# Altium schematic sheet Top.SchDoc: Top
size A3; Project: STM32L073Z-EVAL; Date: Not used; ApprovedBy: Not used; CheckedBy: Not used; Author: Not used; CompanyName: STMicroelectronics; DrawnBy: Not used; Engineer: Not used; Organization: Not used; Address1: Not used; Address2: Not used; Address3: Not used; Address4: Not used; DocumentNumber: 1; Revision: Not used; SheetNumber: 2; SheetTotal: 13; CurrentTime: Not used; CurrentDate: Not used; Time: Not used; DocumentFullPathAndName: Not used; DocumentName: Not used; ModifiedDate: Not used; ImagePath: Not used; ProjectName: Not used; Application_BuildNumber: Not used
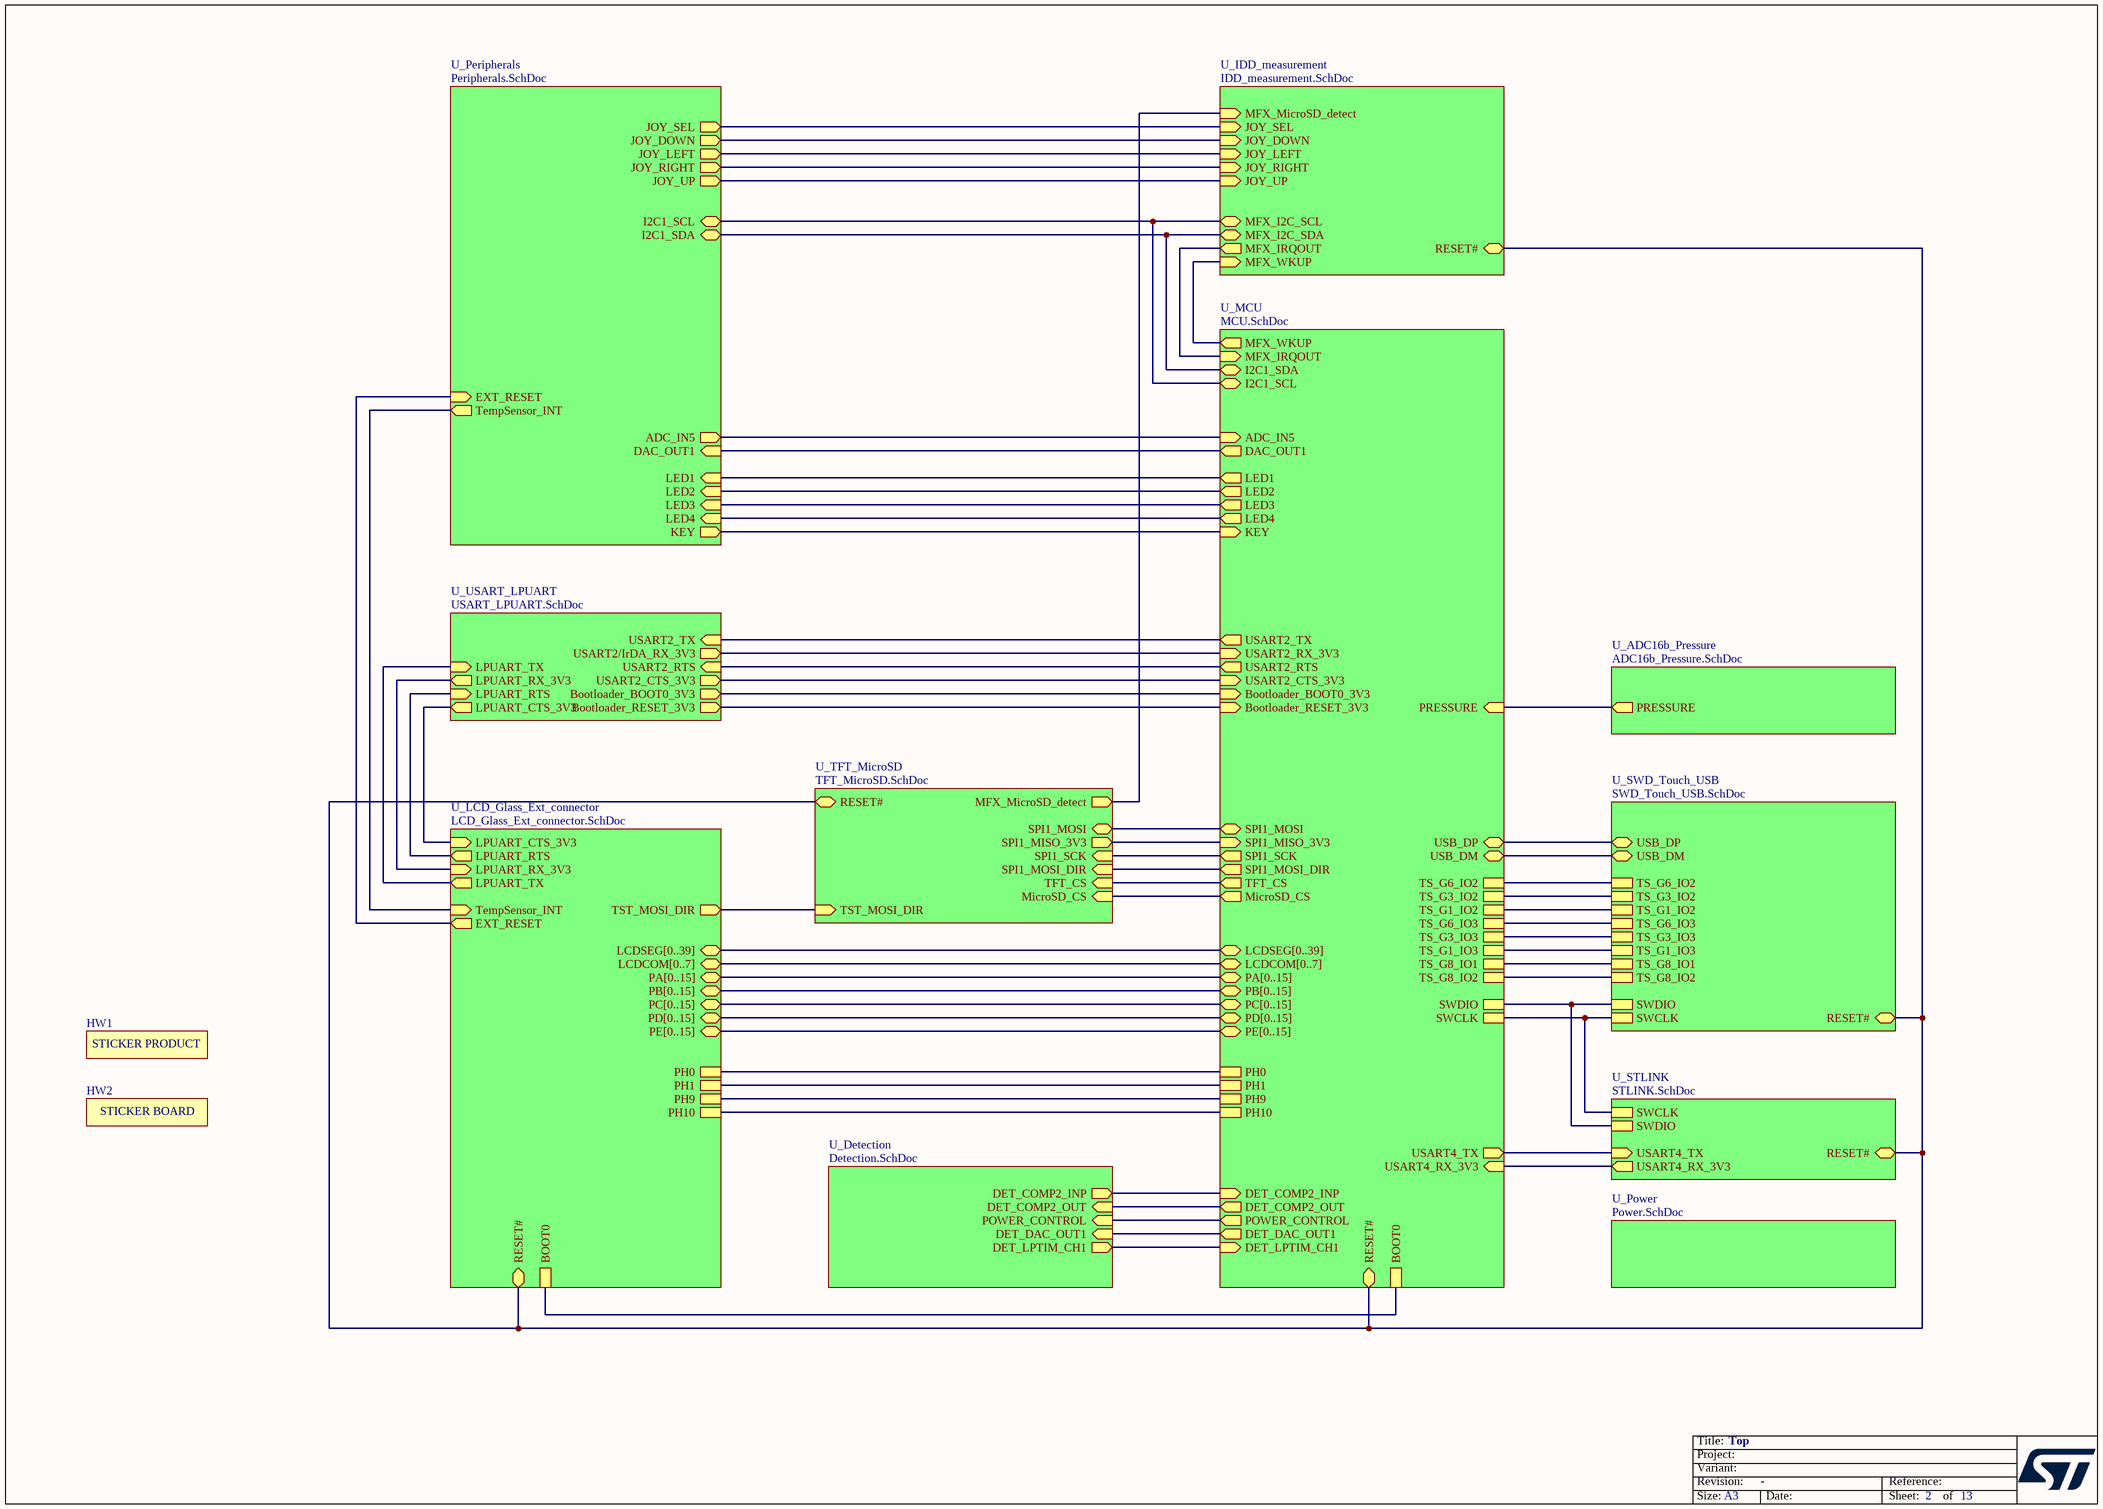
[diagram p0: Top.SchDoc]

## Parts
HW1  STICKER_PRODUCT  (value not drawn)  (no BOM)
HW2  STICKER_BOARD  (value not drawn)  (no BOM)

## Sub-sheets
U_ADC16b_Pressure = ADC16b_Pressure.SchDoc: PRESSURE (out)
U_Detection = Detection.SchDoc: DET_COMP2_INP (out), DET_COMP2_OUT (in), DET_DAC_OUT1 (in), POWER_CONTROL (in), DET_LPTIM_CH1 (out)
U_IDD_measurement = IDD_measurement.SchDoc: MFX_IRQOUT (out), JOY_SEL (in), JOY_DOWN (in), JOY_LEFT (in), JOY_RIGHT (in), JOY_UP (in), MFX_WKUP (in), MFX_MicroSD_detect (in), RESET# (bidir), MFX_I2C_SDA (bidir), MFX_I2C_SCL (bidir)
U_LCD_Glass_Ext_connector = LCD_Glass_Ext_connector.SchDoc: LCDSEG[0..39] (bidir), LCDCOM[0..7] (bidir), LPUART_RX_3V3 (in), LPUART_TX (out), LPUART_CTS_3V3 (in), LPUART_RTS (out), TST_MOSI_DIR (out), TempSensor_INT (in), EXT_RESET (out), PA[0..15] (bidir), PB[0..15] (bidir), PC[0..15] (bidir), PD[0..15] (bidir), PE[0..15] (bidir), RESET# (bidir), PH1, PH0, BOOT0, PH10, PH9
U_MCU = MCU.SchDoc: I2C1_SDA (bidir), I2C1_SCL (bidir), MFX_IRQOUT (in), Bootloader_BOOT0_3V3 (in), Bootloader_RESET_3V3 (in), BOOT0, USART2_RX_3V3 (in), USART2_CTS_3V3 (in), USART2_TX (out), USART2_RTS (out), SPI1_SCK (out), SPI1_MOSI (bidir), MicroSD_CS (out), TFT_CS (out), KEY (in), LED4 (out), LED3 (out), LED1 (out), LED2 (out), USART4_RX_3V3 (in), USART4_TX (out), PRESSURE (in), TS_G1_IO2, TS_G1_IO3, DAC_OUT1 (out), TS_G3_IO2, TS_G3_IO3, TS_G6_IO2, TS_G6_IO3, ADC_IN5 (in), USB_DM (bidir), USB_DP (bidir), SWDIO, SWCLK, SPI1_MISO_3V3 (in), DET_DAC_OUT1 (out), SPI1_MOSI_DIR (out), LCDSEG[0..39] (bidir), LCDCOM[0..7] (bidir), PA[0..15] (bidir), PB[0..15] (bidir), PC[0..15] (bidir), PD[0..15] (bidir), PE[0..15] (bidir), RESET# (bidir), PH1, PH0, PH10, PH9, MFX_WKUP (out), TS_G8_IO1, TS_G8_IO2, DET_COMP2_INP (in), POWER_CONTROL (out), DET_COMP2_OUT (out), DET_LPTIM_CH1 (in)
U_Peripherals = Peripherals.SchDoc: I2C1_SDA (bidir), TempSensor_INT (out), EXT_RESET (in), JOY_SEL (out), JOY_DOWN (out), JOY_LEFT (out), JOY_RIGHT (out), JOY_UP (out), DAC_OUT1 (in), ADC_IN5 (out), KEY (out), LED4 (in), LED3 (in), LED1 (in), LED2 (in), I2C1_SCL (bidir)
U_Power = Power.SchDoc: no entries
U_STLINK = STLINK.SchDoc: USART4_RX_3V3 (out), USART4_TX (in), SWDIO, SWCLK, RESET# (bidir)
U_SWD_Touch_USB = SWD_Touch_USB.SchDoc: RESET# (bidir), SWDIO, SWCLK, USB_DM (bidir), USB_DP (bidir), TS_G1_IO2, TS_G6_IO2, TS_G3_IO2, TS_G6_IO3, TS_G3_IO3, TS_G1_IO3, TS_G8_IO1, TS_G8_IO2
U_TFT_MicroSD = TFT_MicroSD.SchDoc: MFX_MicroSD_detect (out), RESET# (bidir), SPI1_MISO_3V3 (out), SPI1_MOSI (bidir), SPI1_MOSI_DIR (in), SPI1_SCK (in), MicroSD_CS (in), TFT_CS (in), TST_MOSI_DIR (in)
U_USART_LPUART = USART_LPUART.SchDoc: USART2/IrDA_RX_3V3 (out), Bootloader_BOOT0_3V3 (out), Bootloader_RESET_3V3 (out), USART2_CTS_3V3 (out), USART2_TX (in), USART2_RTS (in), LPUART_RX_3V3 (out), LPUART_CTS_3V3 (out), LPUART_TX (in), LPUART_RTS (in)

## Nets
(unnamed): sheet U_MCU/I2C1_SDA, sheet U_IDD_measurement/MFX_I2C_SDA, sheet U_Peripherals/I2C1_SDA
(unnamed): sheet U_MCU/I2C1_SCL, sheet U_IDD_measurement/MFX_I2C_SCL, sheet U_Peripherals/I2C1_SCL
(unnamed): sheet U_MCU/MFX_IRQOUT, sheet U_IDD_measurement/MFX_IRQOUT
(unnamed): sheet U_MCU/Bootloader_BOOT0_3V3, sheet U_USART_LPUART/Bootloader_BOOT0_3V3
(unnamed): sheet U_MCU/Bootloader_RESET_3V3, sheet U_USART_LPUART/Bootloader_RESET_3V3
(unnamed): sheet U_MCU/BOOT0, sheet U_LCD_Glass_Ext_connector/BOOT0
(unnamed): sheet U_MCU/USART2_RX_3V3, sheet U_USART_LPUART/USART2/IrDA_RX_3V3
(unnamed): sheet U_MCU/USART2_CTS_3V3, sheet U_USART_LPUART/USART2_CTS_3V3
(unnamed): sheet U_MCU/USART2_TX, sheet U_USART_LPUART/USART2_TX
(unnamed): sheet U_MCU/USART2_RTS, sheet U_USART_LPUART/USART2_RTS
(unnamed): sheet U_MCU/SPI1_SCK, sheet U_TFT_MicroSD/SPI1_SCK
(unnamed): sheet U_MCU/SPI1_MOSI, sheet U_TFT_MicroSD/SPI1_MOSI
(unnamed): sheet U_MCU/MicroSD_CS, sheet U_TFT_MicroSD/MicroSD_CS
(unnamed): sheet U_MCU/TFT_CS, sheet U_TFT_MicroSD/TFT_CS
(unnamed): sheet U_MCU/KEY, sheet U_Peripherals/KEY
(unnamed): sheet U_MCU/LED4, sheet U_Peripherals/LED4
(unnamed): sheet U_MCU/LED3, sheet U_Peripherals/LED3
(unnamed): sheet U_MCU/LED1, sheet U_Peripherals/LED1
(unnamed): sheet U_MCU/LED2, sheet U_Peripherals/LED2
(unnamed): sheet U_MCU/USART4_RX_3V3, sheet U_STLINK/USART4_RX_3V3
(unnamed): sheet U_MCU/USART4_TX, sheet U_STLINK/USART4_TX
(unnamed): sheet U_MCU/PRESSURE, sheet U_ADC16b_Pressure/PRESSURE
(unnamed): sheet U_MCU/TS_G1_IO2, sheet U_SWD_Touch_USB/TS_G1_IO2
(unnamed): sheet U_MCU/TS_G1_IO3, sheet U_SWD_Touch_USB/TS_G1_IO3
(unnamed): sheet U_MCU/DAC_OUT1, sheet U_Peripherals/DAC_OUT1
(unnamed): sheet U_MCU/TS_G3_IO2, sheet U_SWD_Touch_USB/TS_G3_IO2
(unnamed): sheet U_MCU/TS_G3_IO3, sheet U_SWD_Touch_USB/TS_G3_IO3
(unnamed): sheet U_MCU/TS_G6_IO2, sheet U_SWD_Touch_USB/TS_G6_IO2
(unnamed): sheet U_MCU/TS_G6_IO3, sheet U_SWD_Touch_USB/TS_G6_IO3
(unnamed): sheet U_MCU/ADC_IN5, sheet U_Peripherals/ADC_IN5
(unnamed): sheet U_MCU/USB_DM, sheet U_SWD_Touch_USB/USB_DM
(unnamed): sheet U_MCU/USB_DP, sheet U_SWD_Touch_USB/USB_DP
(unnamed): sheet U_MCU/SWDIO, sheet U_STLINK/SWDIO, sheet U_SWD_Touch_USB/SWDIO
(unnamed): sheet U_MCU/SWCLK, sheet U_STLINK/SWCLK, sheet U_SWD_Touch_USB/SWCLK
(unnamed): sheet U_MCU/SPI1_MISO_3V3, sheet U_TFT_MicroSD/SPI1_MISO_3V3
(unnamed): sheet U_MCU/DET_DAC_OUT1, sheet U_Detection/DET_DAC_OUT1
(unnamed): sheet U_MCU/SPI1_MOSI_DIR, sheet U_TFT_MicroSD/SPI1_MOSI_DIR
(unnamed): sheet U_MCU/RESET#, sheet U_IDD_measurement/RESET#, sheet U_LCD_Glass_Ext_connector/RESET#, sheet U_STLINK/RESET#, sheet U_TFT_MicroSD/RESET#, sheet U_SWD_Touch_USB/RESET#
(unnamed): sheet U_MCU/PH1, sheet U_LCD_Glass_Ext_connector/PH1
(unnamed): sheet U_MCU/PH0, sheet U_LCD_Glass_Ext_connector/PH0
(unnamed): sheet U_MCU/PH10, sheet U_LCD_Glass_Ext_connector/PH10
(unnamed): sheet U_MCU/PH9, sheet U_LCD_Glass_Ext_connector/PH9
(unnamed): sheet U_MCU/MFX_WKUP, sheet U_IDD_measurement/MFX_WKUP
(unnamed): sheet U_MCU/TS_G8_IO1, sheet U_SWD_Touch_USB/TS_G8_IO1
(unnamed): sheet U_MCU/TS_G8_IO2, sheet U_SWD_Touch_USB/TS_G8_IO2
(unnamed): sheet U_MCU/DET_COMP2_INP, sheet U_Detection/DET_COMP2_INP
(unnamed): sheet U_MCU/POWER_CONTROL, sheet U_Detection/POWER_CONTROL
(unnamed): sheet U_MCU/DET_COMP2_OUT, sheet U_Detection/DET_COMP2_OUT
(unnamed): sheet U_MCU/DET_LPTIM_CH1, sheet U_Detection/DET_LPTIM_CH1
(unnamed): sheet U_IDD_measurement/JOY_SEL, sheet U_Peripherals/JOY_SEL
(unnamed): sheet U_IDD_measurement/JOY_DOWN, sheet U_Peripherals/JOY_DOWN
(unnamed): sheet U_IDD_measurement/JOY_LEFT, sheet U_Peripherals/JOY_LEFT
(unnamed): sheet U_IDD_measurement/JOY_RIGHT, sheet U_Peripherals/JOY_RIGHT
(unnamed): sheet U_IDD_measurement/JOY_UP, sheet U_Peripherals/JOY_UP
(unnamed): sheet U_IDD_measurement/MFX_MicroSD_detect, sheet U_TFT_MicroSD/MFX_MicroSD_detect
(unnamed): sheet U_LCD_Glass_Ext_connector/LPUART_RX_3V3, sheet U_USART_LPUART/LPUART_RX_3V3
(unnamed): sheet U_LCD_Glass_Ext_connector/LPUART_TX, sheet U_USART_LPUART/LPUART_TX
(unnamed): sheet U_LCD_Glass_Ext_connector/LPUART_CTS_3V3, sheet U_USART_LPUART/LPUART_CTS_3V3
(unnamed): sheet U_LCD_Glass_Ext_connector/LPUART_RTS, sheet U_USART_LPUART/LPUART_RTS
(unnamed): sheet U_LCD_Glass_Ext_connector/TST_MOSI_DIR, sheet U_TFT_MicroSD/TST_MOSI_DIR
(unnamed): sheet U_LCD_Glass_Ext_connector/TempSensor_INT, sheet U_Peripherals/TempSensor_INT
(unnamed): sheet U_LCD_Glass_Ext_connector/EXT_RESET, sheet U_Peripherals/EXT_RESET

## Buses and harness runs
bus sheet U_LCD_Glass_Ext_connector/LCDCOM[0..7] = sheet U_MCU/LCDCOM[0..7]
bus sheet U_LCD_Glass_Ext_connector/LCDSEG[0..39] = sheet U_MCU/LCDSEG[0..39]
bus sheet U_LCD_Glass_Ext_connector/PA[0..15] = sheet U_MCU/PA[0..15]
bus sheet U_LCD_Glass_Ext_connector/PB[0..15] = sheet U_MCU/PB[0..15]
bus sheet U_LCD_Glass_Ext_connector/PC[0..15] = sheet U_MCU/PC[0..15]
bus sheet U_LCD_Glass_Ext_connector/PD[0..15] = sheet U_MCU/PD[0..15]
bus sheet U_LCD_Glass_Ext_connector/PE[0..15] = sheet U_MCU/PE[0..15]

## Notes on the sheet
- Title:
- Project:
- Size:
- Revision:
- Variant:
- A3
- -
- Date:
- Reference:
- Sheet:
- of
- (in symbol STICKER_BOARD) STICKER BOARD
- (in symbol STICKER_PRODUCT) STICKER PRODUCT